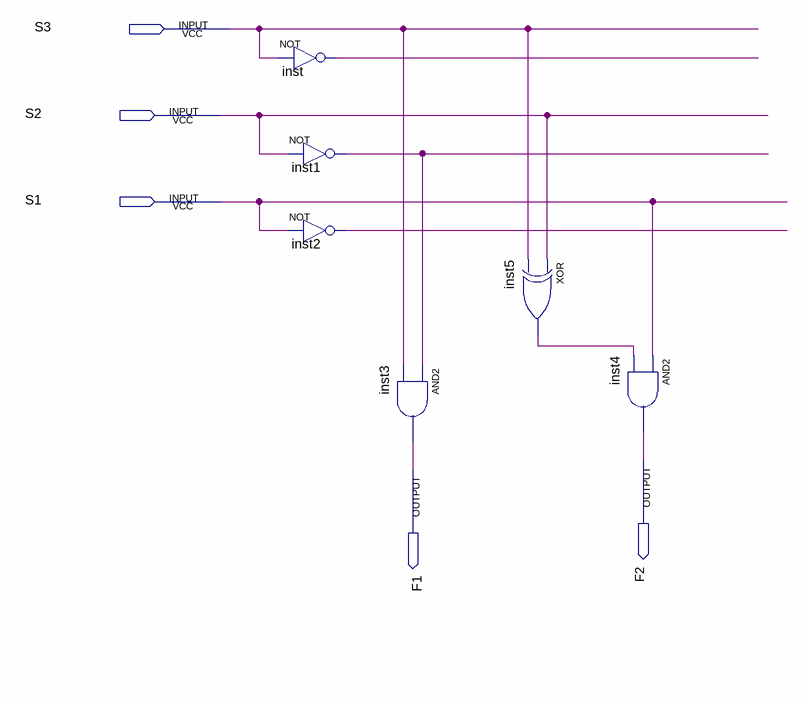
[diagram p0: schematic sheet]
// Quartus schematic decodificador_comparadores.bdf as structural Verilog: 6 symbols, 5 pins
module decodificador_comparadores (
  input  S3,
  input  S2,
  input  S1,
  output F2,
  output F1
);

  wire inst1_out, inst2_out, inst5_out, inst_out;

  not inst (inst_out, S3);
  not inst1 (inst1_out, S2);
  not inst2 (inst2_out, S1);
  and inst3 (F1, inst1_out, S3);
  xor inst5 (inst5_out, S2, S3);
  and inst4 (F2, S1, inst5_out);
endmodule
